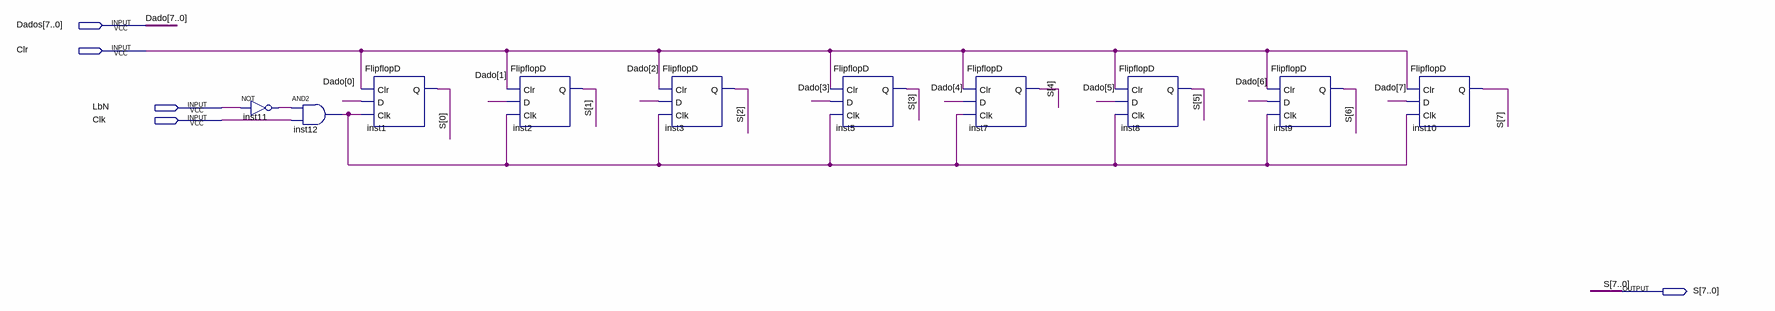
[diagram p0: schematic sheet]
// Quartus schematic register.bdf as structural Verilog: 10 symbols, 5 pins
module register (
  input  [7:0] Dados,
  input  Clr,
  input  LbN,
  input  Clk,
  output [7:0] S
);

  wire inst11_out, inst12_out;

  not inst11 (inst11_out, LbN);
  and inst12 (inst12_out, inst11_out, Clk);
  FlipflopD inst1 (.Clr(Clr), .D(Dados[0]), .Clk(inst12_out), .Q(S[0]));
  FlipflopD inst2 (.Clr(Clr), .D(Dados[1]), .Clk(inst12_out), .Q(S[1]));
  FlipflopD inst3 (.Clr(Clr), .D(Dados[2]), .Clk(inst12_out), .Q(S[2]));
  FlipflopD inst5 (.Clr(Clr), .D(Dados[3]), .Clk(inst12_out), .Q(S[3]));
  FlipflopD inst7 (.Clr(Clr), .D(Dados[4]), .Clk(inst12_out), .Q(S[4]));
  FlipflopD inst8 (.Clr(Clr), .D(Dados[5]), .Clk(inst12_out), .Q(S[5]));
  FlipflopD inst9 (.Clr(Clr), .D(Dados[6]), .Clk(inst12_out), .Q(S[6]));
  FlipflopD inst10 (.Clr(Clr), .D(Dados[7]), .Clk(inst12_out), .Q(S[7]));

  // Other names for the same wires on the sheet: Dado[7:0] = Dados
endmodule
